# EAGLE design adafruit_rgblcdplate (EAGLE 6.3)
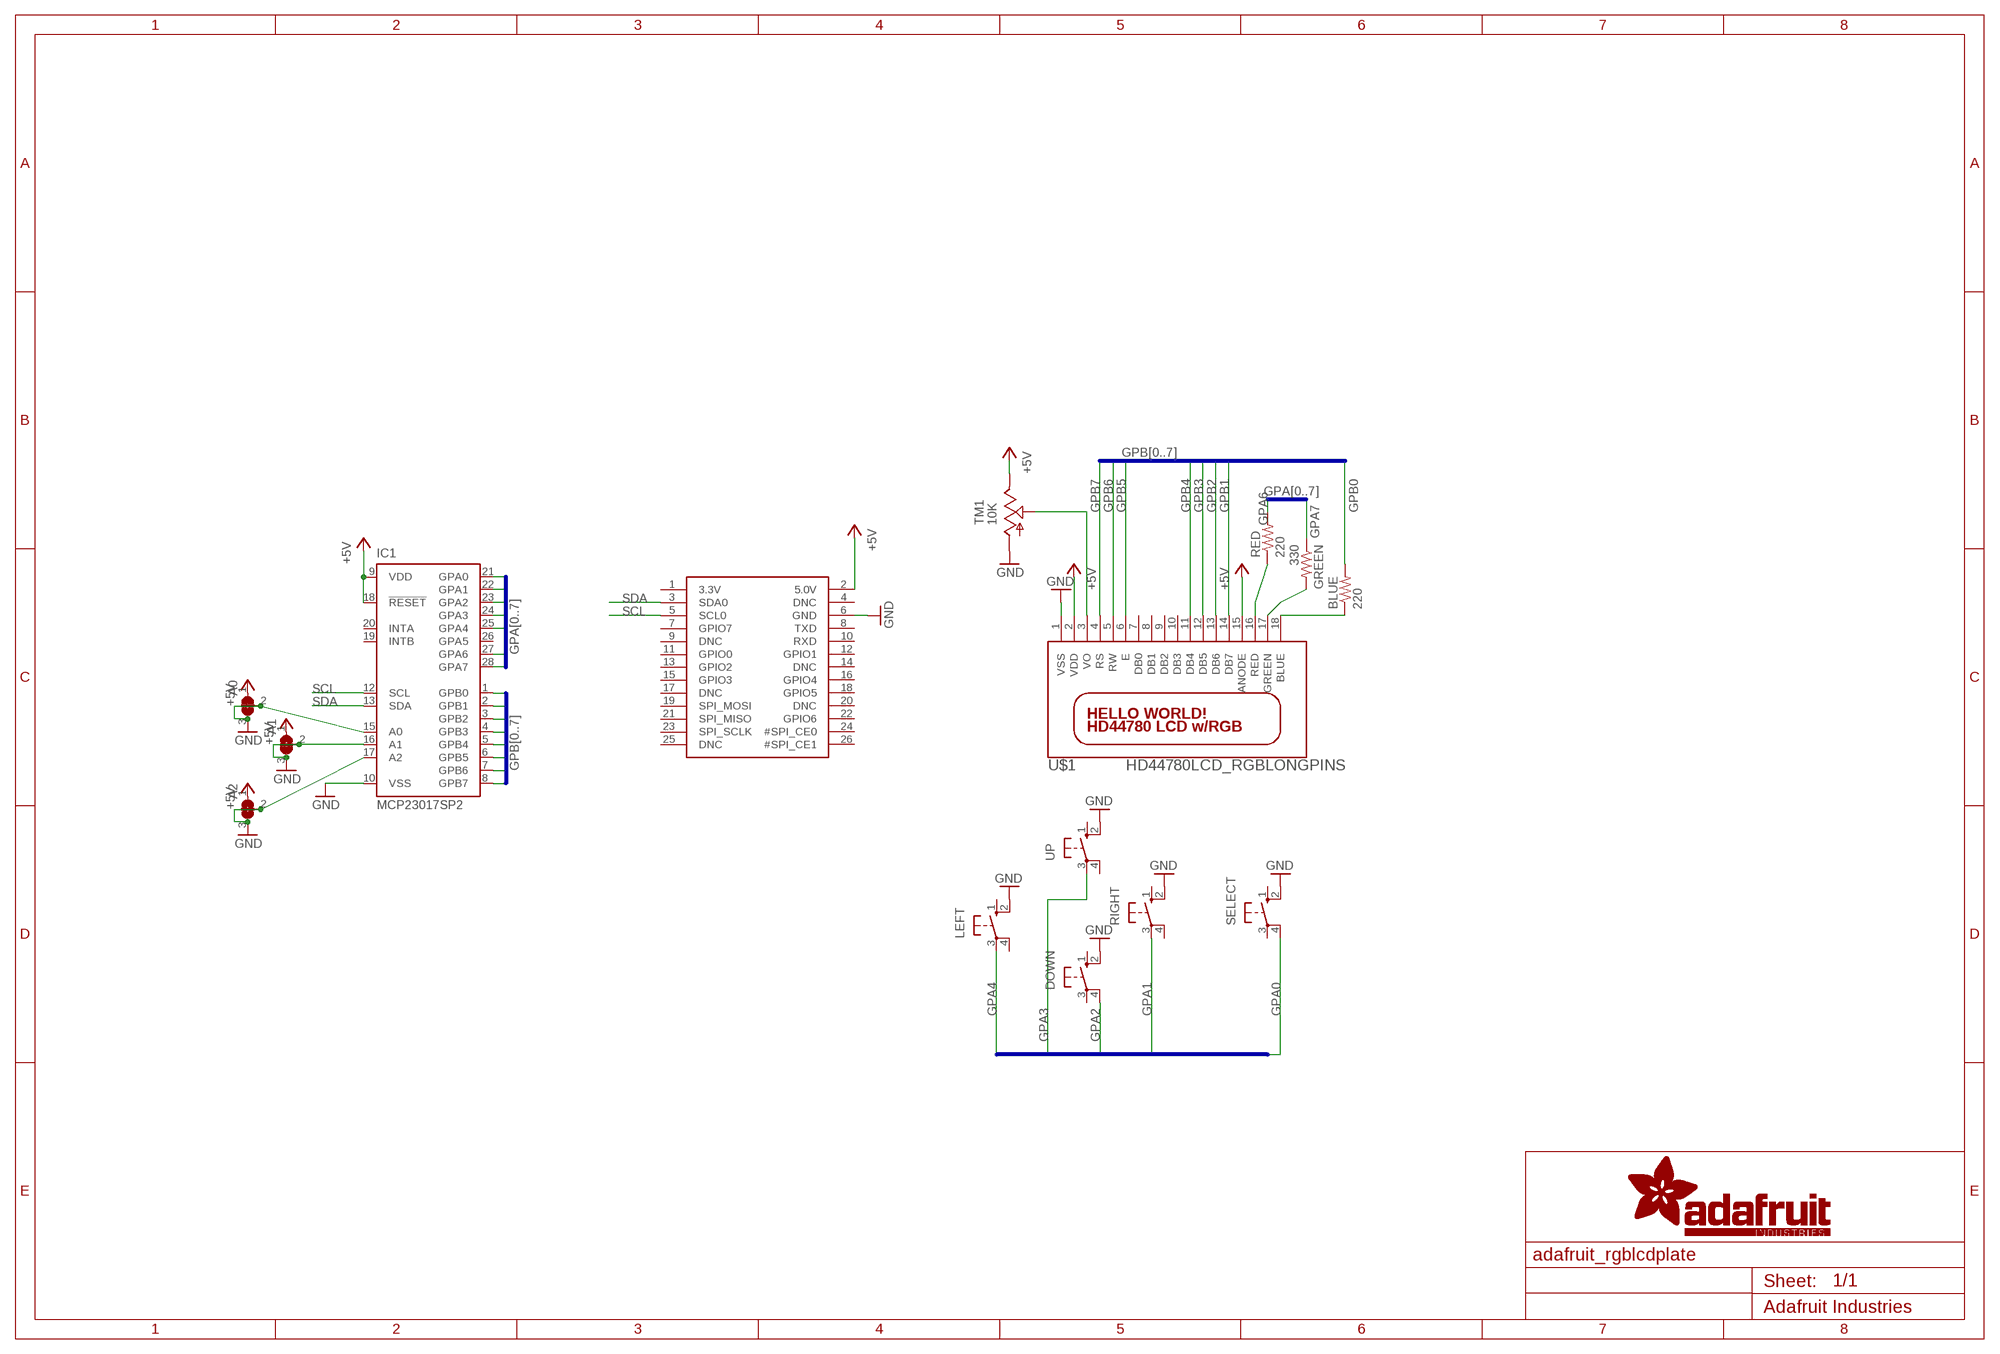
[diagram p0: schematic, sheet 1]

## Parts
A0  SOLDERJUMPER_2WAY  [SOLDERJUMPER_2WAY_OPEN_NOPASTE]
A1  SOLDERJUMPER_2WAY  [SOLDERJUMPER_2WAY_OPEN_NOPASTE]
A2  SOLDERJUMPER_2WAY  [SOLDERJUMPER_2WAY_OPEN_NOPASTE]
BLUE  220  R-US_0207/10  [0207/10]
DOWN  10-XX  [B3F-10XX]
GREEN  330  R-US_0207/10  [0207/10]
IC1  MCP23017SP2  [DIL28-3-ROUND]
LEFT  10-XX  [B3F-10XX]
RED  220  R-US_0207/10  [0207/10]
RIGHT  10-XX  [B3F-10XX]
SELECT  10-XX  [B3F-10XX]
TM1  10K  TRIM  [6MM]
U$1  HD44780LCD_RGBLONGPINS  [LCD1602-RGB]
U$4  RASPBERRYPI_BB  [RASBERRYPI_SHIELD]
UP  10-XX  [B3F-10XX]

## Nets
+5V: A0.1 A1.1 A2.1 IC1.9(VDD) IC1.18(!RESET) TM1.E U$1.2(VDD) U$1.15(ANODE) U$4.2(5.0V)
GND: A0.2 A0.3 A1.2 A1.3 A2.2 A2.3 DOWN.2(S1) IC1.10(VSS) IC1.15(A0) IC1.16(A1) IC1.17(A2) LEFT.2(S1) RIGHT.2(S1) SELECT.2(S1) TM1.A U$1.1(VSS) U$4.6(GND) UP.2(S1)
GPA0: IC1.21(GPA0) SELECT.4(P1)
GPA1: IC1.22(GPA1) RIGHT.3(P)
GPA2: DOWN.4(P1) IC1.23(GPA2)
GPA3: IC1.24(GPA3) UP.3(P)
GPA4: IC1.25(GPA4) LEFT.3(P)
GPA6: IC1.27(GPA6) RED.2
GPA7: GREEN.1 IC1.28(GPA7)
GPB0: BLUE.2 IC1.1(GPB0)
GPB1: IC1.2(GPB1) U$1.14(DB7)
GPB2: IC1.3(GPB2) U$1.13(DB6)
GPB3: IC1.4(GPB3) U$1.12(DB5)
GPB4: IC1.5(GPB4) U$1.11(DB4)
GPB5: IC1.6(GPB5) U$1.6(E)
GPB6: IC1.7(GPB6) U$1.5(RW)
GPB7: IC1.8(GPB7) U$1.4(RS)
N$2: BLUE.1 U$1.18(BLUE)
N$3: GREEN.2 U$1.17(GREEN)
N$4: RED.1 U$1.16(RED)
N$5: TM1.S U$1.3(VO)
SCL: IC1.12(SCL) U$4.5(SCL0)
SDA: IC1.13(SDA) U$4.3(SDA0)
Unconnected: DOWN.1(S) DOWN.3(P) IC1.19(INTB) IC1.20(INTA) IC1.26(GPA5) LEFT.1(S) LEFT.4(P1) RIGHT.1(S) RIGHT.4(P1) SELECT.1(S) SELECT.3(P) U$1.7(DB0) U$1.8(DB1) U$1.9(DB2) U$1.10(DB3) U$4.1(3.3V) U$4.4(DNC) U$4.7(GPIO7) U$4.8(TXD) U$4.9(DNC) U$4.10(RXD) U$4.11(GPIO0) U$4.12(GPIO1) U$4.13(GPIO2) U$4.14(DNC) U$4.15(GPIO3) U$4.16(GPIO4) U$4.17(DNC) U$4.18(GPIO5) U$4.19(SPI_MOSI) U$4.20(DNC) U$4.21(SPI_MISO) U$4.22(GPIO6) U$4.23(SPI_SCLK) U$4.24(#SPI_CE0) U$4.25(DNC) U$4.26(#SPI_CE1) UP.1(S) UP.4(P1)

## Buses
GPB[0..7]
GPA[0..7]

## Library data of the parts
A0 A1 A2 = microbuilder:SOLDERJUMPER_2WAY: 2-Way Solder Jumper
BLUE GREEN RED = adafruit:R-US_: RESISTOR, American symbol
DOWN LEFT RIGHT SELECT UP = switch-omron:10-XX: OMRON SWITCH
IC1 = adafruit:MCP23017: http://ww1.microchip.com/downloads/en/DeviceDoc/21952a.pdf Source: http://ww1.microchip.com/downloads/en/DeviceDoc/21952a.pdf
TM1 = adafruit:TRIM
U$1 = adafruit:HD44780LCD_RGB
U$4 = microbuilder:RASPBERRYPI_B

## Board
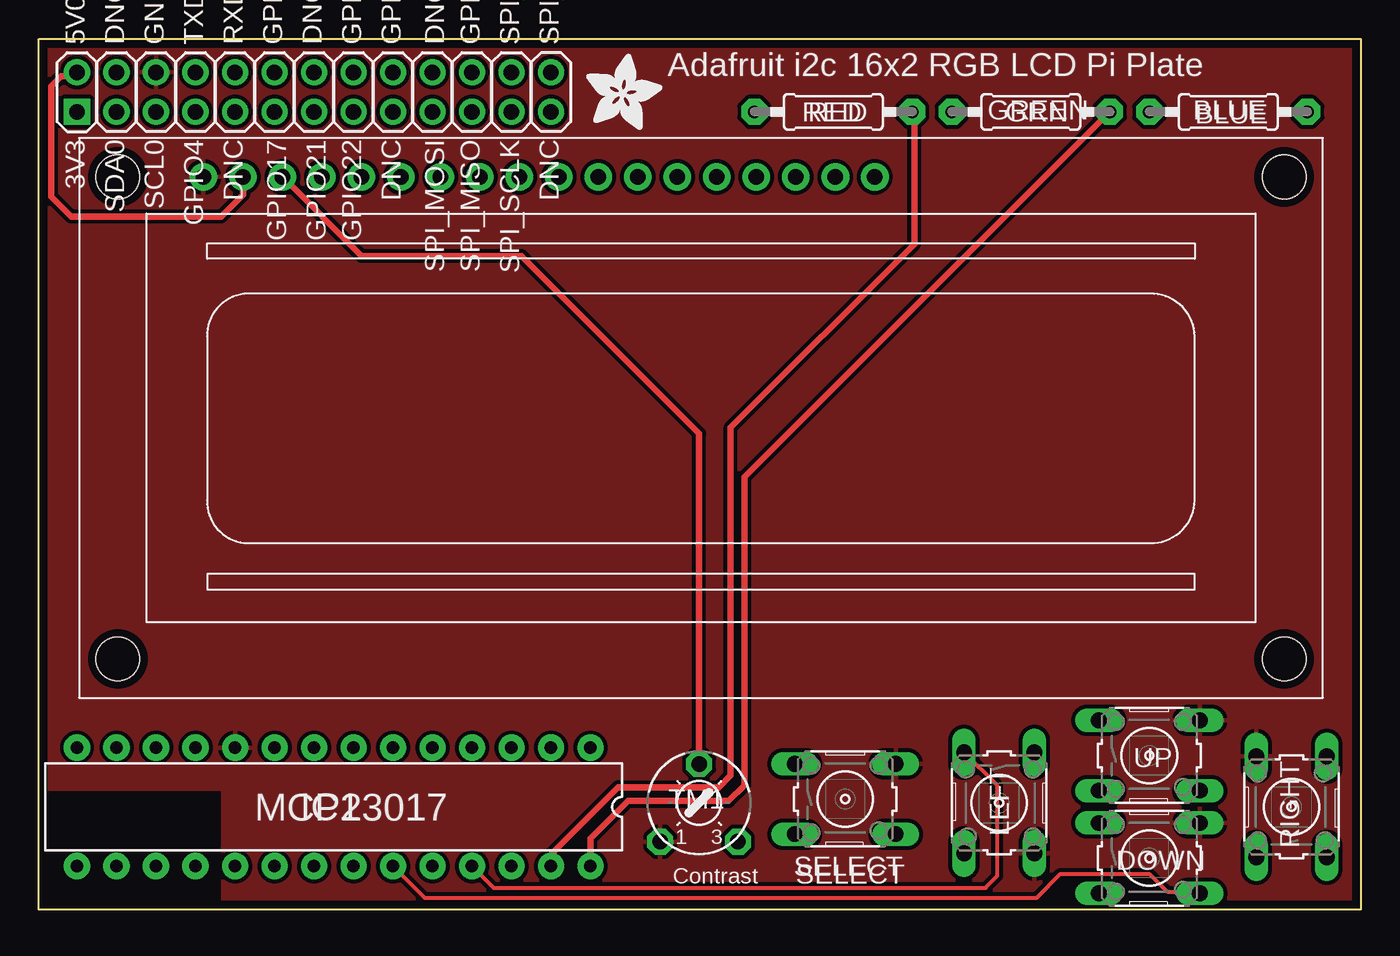
[diagram p1: board, top side]
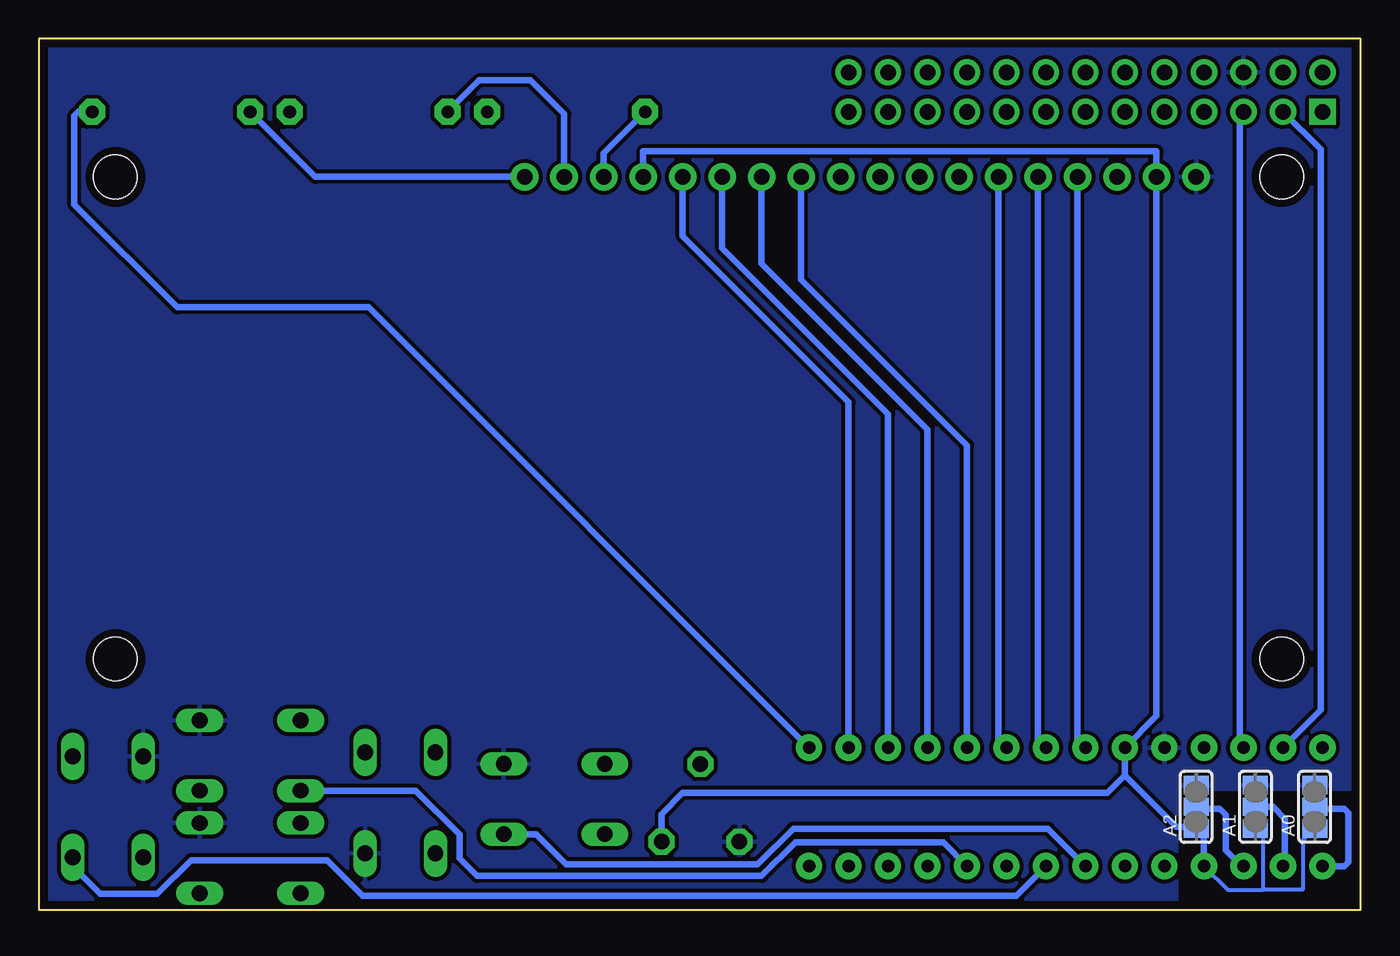
[diagram p2: board, bottom side, seen from below]

Size 85 x 56 mm. Coordinates in mm from the lower left corner, seen from the top.
Copper layers (1*16): Top 0.035mm / dielectric 1.5mm / Bottom 0.035mm
Design rules "default": minimum track width 10mil, minimum drill 19mil, track to track 10mil, track to pad 10mil, pad to pad 16mil, via to via 10mil, smd to smd 8mil, copper to edge 20mil, drill to drill 8mil, minimum pad ring 10mil, minimum via ring 8mil, stop-mask expansion 4mil, vias tented up to drill 20mil, thermal gap 10mil

### Footprints (pad centres in the part's own frame; a part is rotated, then mirrored left to right if it is on the bottom)
SOLDERJUMPER_2WAY_OPEN_NOPASTE = smd 1.168 x 1.6: 1 -1.397,0; 2 0,0; 3 1.397,0
0207/10 = drill 0.813 pad 1.676 octagon: 1 -5.08,0; 2 5.08,0
B3F-10XX = drill 1.016 long: 1 -3.251,2.261; 2 3.251,2.261; 3 -3.251,-2.261; 4 3.251,-2.261
DIL28-3-ROUND = drill 0.813 pad 1.676: 1 -16.51,-3.81; 2 -13.97,-3.81; 3 -11.43,-3.81; 4 -8.89,-3.81; 5 -6.35,-3.81; 6 -3.81,-3.81; 7 -1.27,-3.81; 8 1.27,-3.81; 9 3.81,-3.81; 10 6.35,-3.81; 11 8.89,-3.81; 12 11.43,-3.81; 13 13.97,-3.81; 14 16.51,-3.81; 15 16.51,3.81; 16 13.97,3.81; 17 11.43,3.81; 18 8.89,3.81; 19 6.35,3.81; 20 3.81,3.81; 21 1.27,3.81; 22 -1.27,3.81; 23 -3.81,3.81; 24 -6.35,3.81; 25 -8.89,3.81; 26 -11.43,3.81; 27 -13.97,3.81; 28 -16.51,3.81
6MM = drill 1 pad 1.676 octagon: A -2.5,-2.5; E 2.5,-2.5; S 0,2.5
LCD1602-RGB = drill 1 pad 1.778: 1 -32,15.5; 2 -29.46,15.5; 3 -26.92,15.5; 4 -24.38,15.5; 5 -21.84,15.5; 6 -19.3,15.5; 7 -16.76,15.5; 8 -14.22,15.5; 9 -11.68,15.5; 10 -9.14,15.5; 11 -6.6,15.5; 12 -4.06,15.5; 13 -1.52,15.5; 14 1.02,15.5; 15 3.56,15.5; 16 6.1,15.5; 17 8.64,15.5; 18 11.18,15.5 | hole 2.8: -37.5,-15.5; -37.5,15.5; 37.5,15.5; 37.5,-15.5
RASBERRYPI_SHIELD = drill 1 pad 1.676 square: 1 51.308,82.55 | drill 1 pad 1.676: 2 53.848,82.55; 3 51.308,80.01; 4 53.848,80.01; 5 51.308,77.47; 6 53.848,77.47; 7 51.308,74.93; 8 53.848,74.93; 9 51.308,72.39; 10 53.848,72.39; 11 51.308,69.85; 12 53.848,69.85; 13 51.308,67.31; 14 53.848,67.31; 15 51.308,64.77; 16 53.848,64.77; 17 51.308,62.23; 18 53.848,62.23; 19 51.308,59.69; 20 53.848,59.69; 21 51.308,57.15; 22 53.848,57.15; 23 51.308,54.61; 24 53.848,54.61; 25 51.308,52.07; 26 53.848,52.07

### Placement (x,y rotation side)
A0  2.96,6.6 90 bottom
A1  6.77,6.6 90 bottom
A2  10.58,6.6 90 bottom
BLUE  76.49,51.31 0 top
DOWN  71.41,3.3 0 top
GREEN  63.79,51.31 180 top
IC1  18.96,6.6 180 top
LEFT  61.76,6.86 270 top
RED  51.09,51.31 0 top
RIGHT  80.56,6.6 90 top
SELECT  51.85,7.11 0 top
TM1  42.46,6.86 0 top
U$1  42.58,31.62 0 top
U$2  [ADAFRUIT_5MM]  35.22,50.16 0 top
U$4  85,0 90 top
UP  71.41,9.91 0 top

### Tracks (layer width: path | path; a pad name or v marks a point on that pad's centre or on a via)
+5V
  Top 0.406: U$1.2 13.12,45.98 11.72,44.58 2.07,44.58 0.8,45.85 0.8,52.96 1.43,53.59 2.2,53.59 U$4.2
  Bottom 0.254: A0.1 3.72,4.45 3.72,1.27 6.26,1.27 | 6.26,1.27 6.26,4.7 A1.1 | IC1.18 8.55,1.27 6.26,1.27
  Bottom 0.406: U$1.15 46.14,48.77 13.12,48.77 U$1.2 13.12,12.44 IC1.9 15.15,8.64 | IC1.18 10.07,4.7 A2.1 10.71,5.33 11.85,5.33 15.15,8.64 | 15.15,8.64 16.29,7.49 43.6,7.49 44.96,6.14 TM1.E
GND
  Bottom 0.406: A2.3 A2.2 10.45,6.48 9.05,6.48 8.67,6.1 8.67,3.81 7.66,2.79 IC1.17 | A1.3 A1.2 5.63,6.6 4.86,5.84 4.86,2.92 IC1.16 | A0.3 A0.2 2.83,6.48 1.05,6.48 0.8,6.22 0.8,3.05 1.05,2.79 IC1.15
  pour Bottom: 0.04,55.88 -0.09,7.75 11.85,7.75 11.85,-0.38 85.13,-0.13 85.13,55.88
  pour Top: 0.04,55.88 -0.09,7.75 11.85,7.75 11.85,-0.25 85.13,-0.13 85.13,55.88
GPA0
  Bottom 0.406: IC1.21 20.1,5.21 36.49,5.21 38.77,2.92 51.09,2.92 53.02,4.85 SELECT.4
GPA1
  Bottom 0.406: IC1.22 22.14,0.89 64.17,0.89 66.46,3.17 75.22,3.17 77.38,1.02 81.06,1.02 82.82,2.77 RIGHT.3
GPA2
  Top 0.254: IC1.23 24.8,0.76 64.17,0.76 65.7,2.29 71.41,2.29 72.55,1.14 73.95,1.14 74.05,1.04 DOWN.4
GPA3
  Bottom 0.406: IC1.24 26.83,4.32 36.36,4.32 38.52,2.16 56.81,2.16 57.95,3.3 57.95,4.83 60.77,7.65 UP.3
GPA4
  Top 0.254: IC1.25 29.25,1.4 60.87,1.4 61.63,2.16 61.63,7.98 LEFT.3
GPA6
  Top 0.406: IC1.27 32.93,3.56 37.25,7.87 43.73,7.87 44.49,8.64 44.49,30.99 56.3,42.8 56.3,51.18 RED.2
GPA7
  Top 0.406: IC1.28 35.47,4.57 37.88,6.99 44.36,6.99 45.38,8 45.38,27.81 GREEN.1
GPB0
  Bottom 0.406: IC1.1 63.79,38.73 76.11,38.73 82.71,45.34 82.71,51.05 82.46,51.31 BLUE.2
GPB1
  Bottom 0.406: IC1.2 32.93,32.64 43.6,43.31 U$1.14
GPB2
  Bottom 0.406: IC1.3 30.39,31.88 41.06,42.54 U$1.13
GPB3
  Bottom 0.406: IC1.4 27.85,30.86 38.52,41.53 U$1.12
GPB4
  Bottom 0.406: IC1.5 25.31,29.85 35.98,40.51 U$1.11
GPB5
  Bottom 0.406: IC1.6 23.28,10.93 U$1.6
GPB6
  Bottom 0.406: IC1.7 20.74,10.93 U$1.5
GPB7
  Bottom 0.406: IC1.8 18.2,10.93 U$1.4
N$2
  Bottom 0.406: U$1.18 67.23,47.12 BLUE.1
N$3
  Bottom 0.406: U$1.17 51.22,51.18 53.38,53.34 56.68,53.34 GREEN.2
N$4
  Bottom 0.406: U$1.16 48.68,48.64 RED.1
N$5
  Top 0.406: TM1.S 42.46,30.61 31.03,42.04 20.75,42.04 U$1.3
SCL
  Bottom 0.406: IC1.12 7.78,10.67 7.78,50.8 7.53,51.05 U$4.5
SDA
  Bottom 0.406: IC1.13 2.58,12.83 2.58,48.89 U$4.3

### Text on the board
tPlace: Adafruit i2c 16x2 RGB LCD Pi Plate | RED | GRN | BLUE | MCP23017 | Contrast | SELECT